# EAGLE schematic Schematic01 (EAGLE 7.4.0)
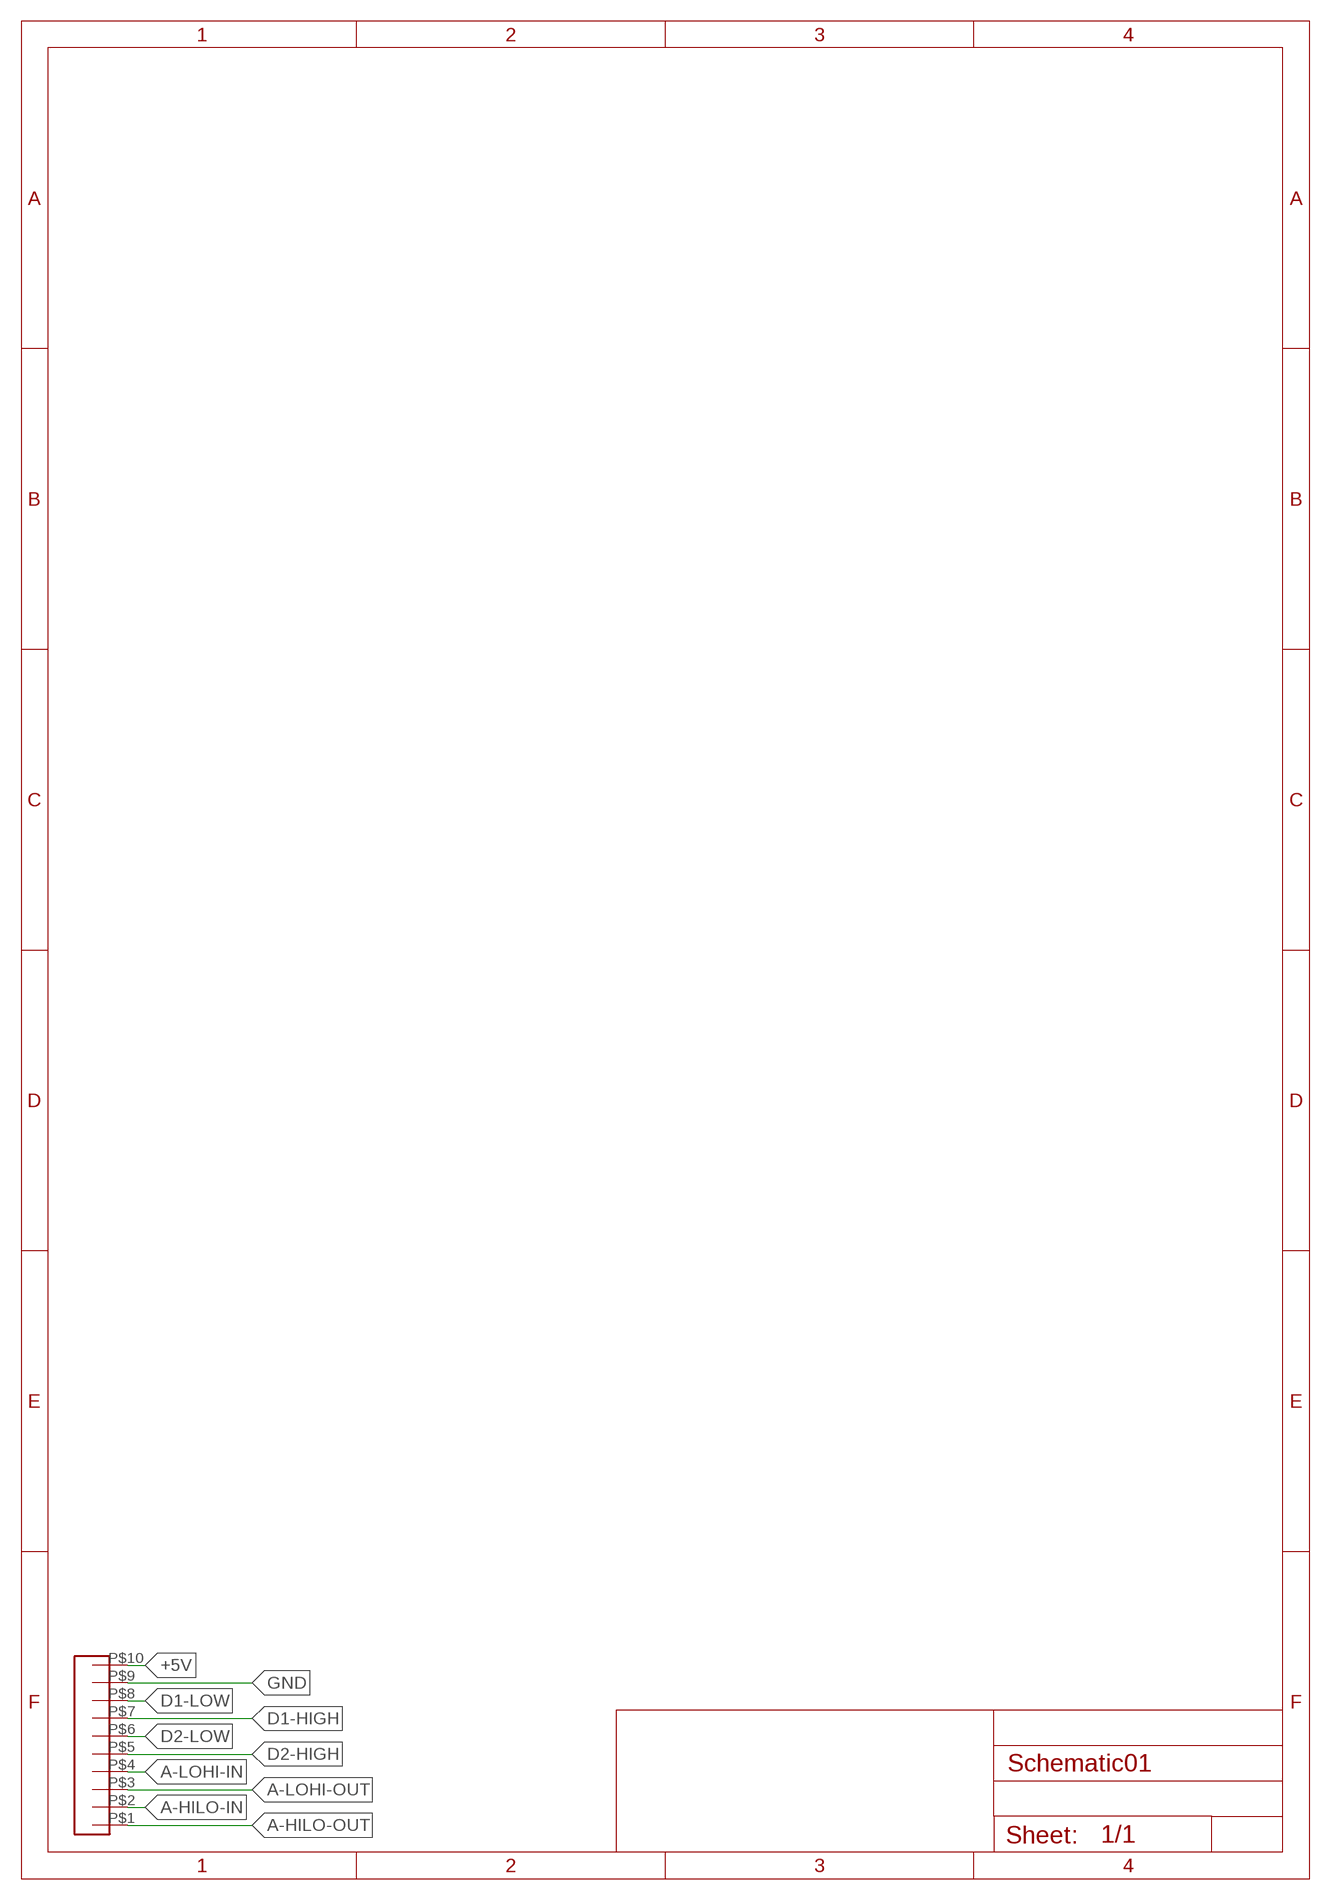
[diagram p0: schematic, sheet 1]

## Parts
U$1  5.08PITCHTERMINAL  [10KPL508]

## Nets
+5V: U$1.P$10
A-HILO-IN: U$1.P$2
A-HILO-OUT: U$1.P$1
A-LOHI-IN: U$1.P$4
A-LOHI-OUT: U$1.P$3
D1-HIGH: U$1.P$7
D1-LOW: U$1.P$8
D2-HIGH: U$1.P$5
D2-LOW: U$1.P$6
GND: U$1.P$9

## Library data of the parts
U$1 = ruuviliitin:5.08PITCHTERMINAL